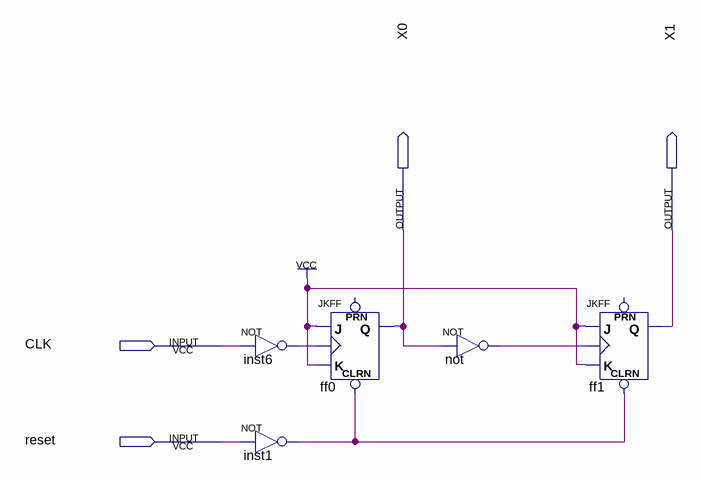
[diagram p0: schematic sheet]
// Quartus schematic 2upcounter.bdf as structural Verilog: 5 symbols, 4 pins
module \2upcounter  (
  input  CLK,
  input  reset,
  output X0,
  output X1
);

  wire inst1_out, inst6_out, not_out;

  not inst6 (inst6_out, CLK);
  not inst1 (inst1_out, reset);
  JKFF ff0 (.CLRN(inst1_out), .K(1'b1), .J(1'b1), .CLK(inst6_out), .Q(X0));  // open: PRN
  not \not  (not_out, X0);
  JKFF ff1 (.CLRN(inst1_out), .K(1'b1), .J(1'b1), .CLK(not_out), .Q(X1));  // open: PRN
endmodule
